# Altium schematic sheet State.SchDoc
size A4
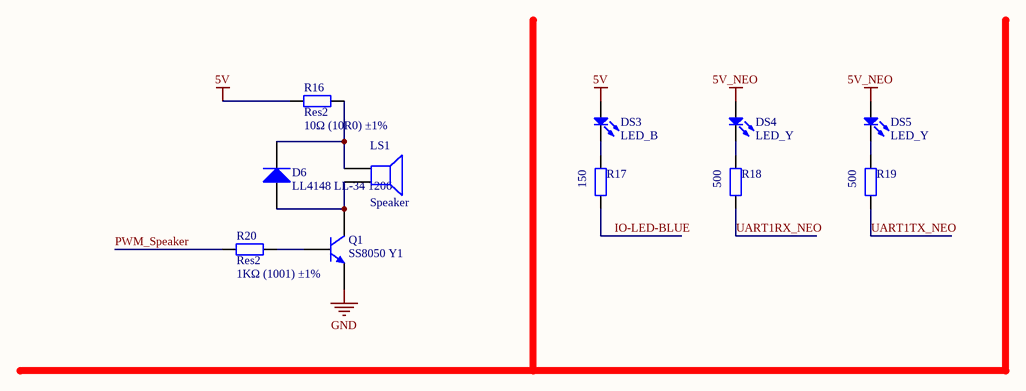
[diagram p0: State.SchDoc]

## Parts
D6  LL4148 LL-34 1206  [LL-34]
DS3  LED_B  [LED0603]
DS4  LED_Y  [LED0603]
DS5  LED_Y  [LED0603]
LS1  Speaker  [MLT-5030]
Q1  SS8050 Y1  [SOT-23(SOT-23-3)]
R16  Res2  value 10Ω (10R0) ±1%  [R1206]
R17  150  [R0603]
R18  500  [R0603]
R19  500  [R0603]
R20  Res2  value 1KΩ (1001) ±1%  [R0603]

## Nets
5V: DS3.1(A) R16.1
5V_NEO: DS4.1(A) DS5.1(A)
GND: Q1.2(E)
IO-LED-BLUE: R17.2
PWM_Speaker: R20.1
UART1RX_NEO: R18.2
UART1TX_NEO: R19.2
NetD6_1: D6.1(A) LS1.2 Q1.3(C)
NetD6_2: D6.2(K) LS1.1 R16.2
NetDS3_2: DS3.2(K) R17.1
NetDS4_2: DS4.2(K) R18.1
NetDS5_2: DS5.2(K) R19.1
NetQ1_1: Q1.1(B) R20.2

## Library data of the parts
D6 = LL-34 LL4148 LL-34 1206: 开关二极管; ComponentLink1Description: 供应商链接; ComponentLink1URL: http://www.szlcsc.com/product/details_10338.html; Package: LL-34; Supplier: LC; SuppliersPartNumber: C9808
DS3-DS5 = LED: Typical RED, GREEN, YELLOW, AMBER GaAs LED; Published: 8-Jun-2000; LatestRevisionDate: 17-Jul-2002; LatestRevisionNote: Re-released for DXP Platform.; PackageDocument: Feb-2002; PackageReference: 3.2X1.6X1.1; Publisher: Altium Limited
LS1 = Speaker: Loudspeaker; Published: 24-Mar-1999; LatestRevisionDate: 17-Jul-2002; LatestRevisionNote: Re-released for DXP Platform.; PackageReference: PIN2; Publisher: Altium Limited
Q1 = SOT-23 SS8050 Y1: 三极管; ComponentLink1Description: 供应商链接; ComponentLink1URL: http://www.szlcsc.com/product/details_2507.html; Package: SOT-23; Supplier: LC; SuppliersPartNumber: C2150
R16-R20 = Res2: Resistor; Published: 8-Jun-2000; LatestRevisionDate: 17-Jul-2002; LatestRevisionNote: Re-released for DXP Platform.; Publisher: Altium Limited
  R16 R20: PackageReference: AXIAL-0.4; PackageDescription: Axial Device, Thru-Hole; 2 Leads; 0.4 in Pin Spacing